# Altium schematic sheet POWER_SUPPLY.SchDoc
size 420 x 297 mm; SheetNumber: 2; SheetTotal: 32; DocumentTypeShort: Э3; DocumentInvertoryNumber: ㅤ
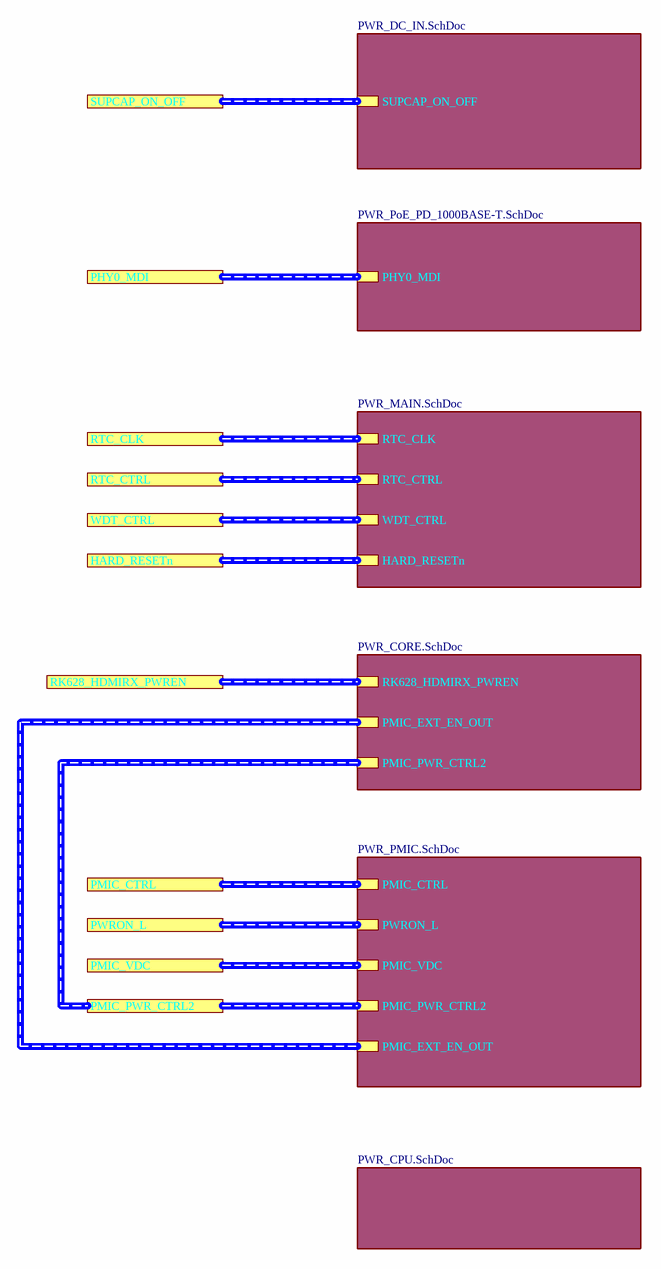
[diagram p0: POWER_SUPPLY.SchDoc]

## Sub-sheets
PWR_CORE = PWR_CORE.SchDoc: PMIC_PWR_CTRL2 (harness CORE_CTRL), PMIC_EXT_EN_OUT (harness CORE_CTRL), RK628_HDMIRX_PWREN (harness CORE_CTRL)
PWR_CPU = PWR_CPU.SchDoc: no entries
PWR_DC_IN = PWR_DC_IN.SchDoc: SUPCAP_ON_OFF (harness SUPCAP_ON_OFF)
PWR_MAIN = PWR_MAIN.SchDoc: RTC_CLK (harness RTC_CLK), RTC_CTRL (harness RTC_CTRL), WDT_CTRL (harness WDT_CTRL), HARD_RESETn (harness RTC_CLK)
PWR_PMIC = PWR_PMIC.SchDoc: PMIC_CTRL (harness PMIC_CTRL), PWRON_L (harness PWRON_L), PMIC_VDC (harness PMIC_VDC), PMIC_PWR_CTRL2 (harness CORE_CTRL), PMIC_EXT_EN_OUT (harness CORE_CTRL)
PWR_PoE_PD_1000BASE-T = PWR_PoE_PD_1000BASE-T.SchDoc: PHY0_MDI (harness PHY0_MDI)

## Ports
HARD_RESETn, PHY0_MDI, PMIC_CTRL, PMIC_PWR_CTRL2, PMIC_VDC, PWRON_L, RK628_HDMIRX_PWREN, RTC_CLK, RTC_CTRL, SUPCAP_ON_OFF, WDT_CTRL

## Buses and harness runs
harness port HARD_RESETn = sheet PWR_MAIN/HARD_RESETn
harness port PHY0_MDI = sheet PWR_PoE_PD_1000BASE-T/PHY0_MDI
harness port PMIC_CTRL = sheet PWR_PMIC/PMIC_CTRL
harness port PMIC_PWR_CTRL2 = sheet PWR_CORE/PMIC_PWR_CTRL2 = sheet PWR_PMIC/PMIC_PWR_CTRL2
harness port PMIC_VDC = sheet PWR_PMIC/PMIC_VDC
harness port PWRON_L = sheet PWR_PMIC/PWRON_L
harness port RK628_HDMIRX_PWREN = sheet PWR_CORE/RK628_HDMIRX_PWREN
harness port RTC_CLK = sheet PWR_MAIN/RTC_CLK
harness port RTC_CTRL = sheet PWR_MAIN/RTC_CTRL
harness port SUPCAP_ON_OFF = sheet PWR_DC_IN/SUPCAP_ON_OFF
harness port WDT_CTRL = sheet PWR_MAIN/WDT_CTRL
harness sheet PWR_CORE/PMIC_EXT_EN_OUT = sheet PWR_PMIC/PMIC_EXT_EN_OUT

## Notes on the sheet
- Подп. и дата
- Инв. № дубл.
- Взам. инв. №
- Инв. № подл.
- Изм.
- Лист
- № докум.
- Подп.
- Дата
- Копировал
- Формат А3